# Altium schematic sheet SW_PDA_DPNOx5.SCHDOC: PDA-Style 5 x DPNO Switch
size A4; Organization: Altium Limited.; Address1: Level 3, 12a Rodborough Rd; Address2: Frenchs Forest 2086; Address3: NSW; Address4: AUSTRALIA; Revision: 6; SheetNumber: 61; SheetTotal: 64; PageSetup: Record=PageOptions|CenterHorizontal=True|CenterVertical=True|PrintScale=0.97|XCorrection=1.00|YCorrection=1.00|PrintKind=0|BorderSize=5000000|LeftOffset=0|BottomOffset=0|Orientation=2|PaperLength=1000|PaperWidth=1000|Scale=100|PaperSource=7|PrintQuality=-4|MediaType=1|DitherType=10|PaperKind=A4|PrintScaleMode=1
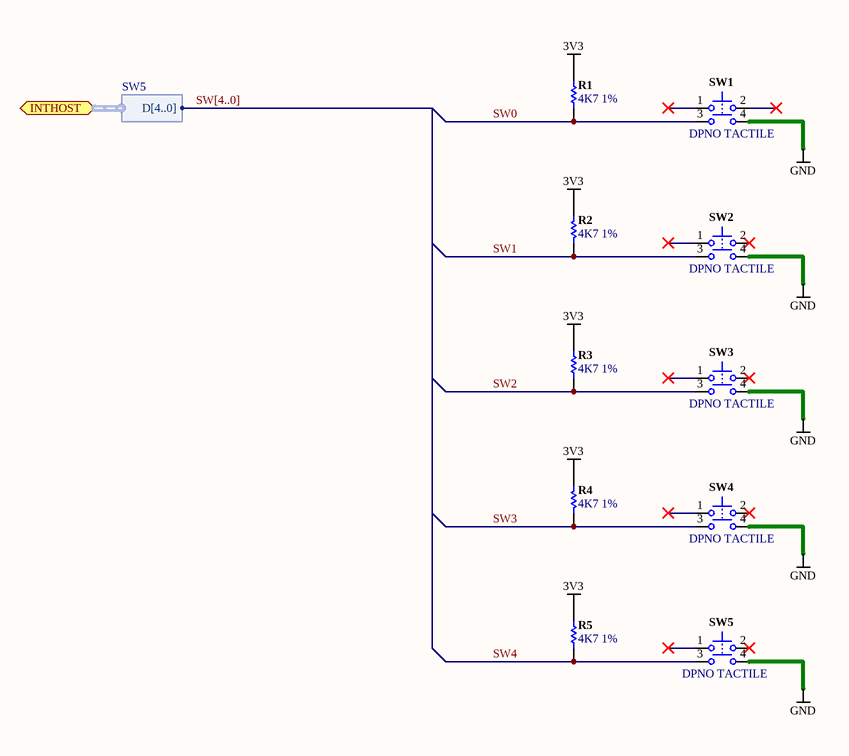
[diagram p0: SW_PDA_DPNOx5.SCHDOC]

## Parts
R1  4K7 1%  [RESC1005-STAR]
R2  4K7 1%  [RESC1005-STAR]
R3  4K7 1%  [RESC1005-STAR]
R4  4K7 1%  [RESC1005-STAR]
R5  4K7 1%  [RESC1005-STAR]
SW1  DPNO TACTILE  [IT-2175]
SW2  DPNO TACTILE  [IT-2175]
SW3  DPNO TACTILE  [IT-2175]
SW4  DPNO TACTILE  [IT-2175]
SW5  DPNO TACTILE  [IT-2175]

## Ports
INTHOST (harness SW5)

## Harnesses
SW5: D[4..0]

## Nets
3V3: R1.1 R2.1 R3.2 R4.1 R5.2
GND: SW1.4 SW2.4 SW3.4 SW4.4 SW5.4
SW0: R1.2 SW1.3
SW1: R2.2 SW2.3
SW2: R3.1 SW3.3
SW3: R4.2 SW4.3
SW4: R5.1 SW5.3

Not connected (* = marked no-connect by the designer): SW1 1* 2*; SW2 1* 2*; SW3 1* 2*; SW4 1* 2*; SW5 1* 2*

## Buses and harness runs
bus SW[4..0]

## Notes on the sheet
- Sheet Title
- Project Title
- Size:
- Date:
- A4
- Assy:
- Time:
- Sheet
- Revision:
- of
- File:

## Library data of the parts
R1-R5 = D-100-0088: Resistor, 4K7 1% 0402 (1005); Power Rating: 63 mW; Resistance: 4.7 K; Category: Resistor; Mounting Technology: Surface Mount; Status: Production; Tolerance: 1 %
SW1-SW5 = D-301-0002: Switch, DPNO Push Button Through-Hole; Category: Switch; Status: Production